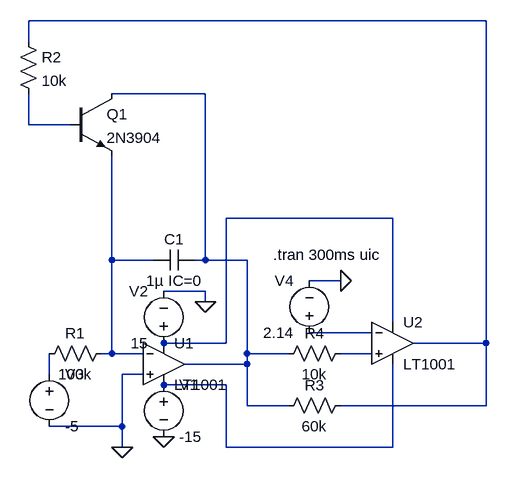
[diagram p0: schematic sawtoothSymbol.asc]
sawtoothSymbol.asc, the LTspice schematic file:
Version 4.1
SHEET 1 1060 680
WIRE 592 -352 -112 -352
WIRE -112 -320 -112 -352
WIRE 160 -240 16 -240
WIRE -112 -192 -112 -240
WIRE -48 -192 -112 -192
WIRE 448 -48 192 -48
WIRE 16 16 16 -144
WIRE 80 16 16 16
WIRE 160 16 160 -240
WIRE 160 16 144 16
WIRE 224 16 160 16
WIRE 368 48 320 48
WIRE 160 64 96 64
WIRE 160 80 160 64
WIRE 448 112 448 -48
WIRE 416 128 320 128
WIRE 192 144 192 -48
WIRE 192 144 96 144
WIRE 592 144 592 -352
WIRE 592 144 480 144
WIRE 16 160 16 16
WIRE 16 160 0 160
WIRE 64 160 16 160
WIRE 224 160 224 16
WIRE 288 160 224 160
WIRE 416 160 368 160
WIRE 224 176 224 160
WIRE 224 176 128 176
WIRE -80 192 -80 160
WIRE 64 192 32 192
WIRE 192 208 96 208
WIRE 224 240 224 176
WIRE 288 240 224 240
WIRE 592 240 592 144
WIRE 592 240 368 240
WIRE 32 272 32 192
WIRE 32 272 -80 272
WIRE 32 304 32 272
WIRE 192 304 192 208
WIRE 448 304 448 176
WIRE 448 304 192 304
FLAG 160 80 0
FLAG 96 288 0
FLAG 32 304 0
FLAG 368 48 0
SYMBOL OpAmps\\LT1001 96 112 R0
SYMATTR InstName U1
SYMBOL voltage 96 192 R0
WINDOW 123 0 0 Left 0
WINDOW 39 0 0 Left 0
SYMATTR InstName V1
SYMATTR Value -15
SYMBOL voltage 96 160 R180
WINDOW 0 24 96 Left 2
WINDOW 3 24 16 Left 2
WINDOW 123 0 0 Left 0
WINDOW 39 0 0 Left 0
SYMATTR InstName V2
SYMATTR Value 15
SYMBOL cap 144 0 R90
WINDOW 0 0 32 VBottom 2
WINDOW 3 32 32 VTop 2
SYMATTR InstName C1
SYMATTR Value 1µ IC=0
SYMBOL res 16 144 R90
WINDOW 0 0 56 VBottom 2
WINDOW 3 32 56 VTop 2
SYMATTR InstName R1
SYMATTR Value 100k
SYMBOL voltage -80 176 R0
WINDOW 123 0 0 Left 0
WINDOW 39 0 0 Left 0
SYMATTR InstName V3
SYMATTR Value -5
SYMBOL voltage 320 144 R180
WINDOW 0 24 96 Left 2
WINDOW 3 24 16 Left 2
WINDOW 123 0 0 Left 0
WINDOW 39 0 0 Left 0
SYMATTR InstName V4
SYMATTR Value 2.14
SYMBOL npn -48 -240 R0
SYMATTR InstName Q1
SYMATTR Value 2N3904
SYMBOL res -128 -336 R0
SYMATTR InstName R2
SYMATTR Value 10k
SYMBOL OpAmps\\LT1001 448 80 R0
SYMATTR InstName U2
SYMBOL res 384 144 R90
WINDOW 0 0 56 VBottom 2
WINDOW 3 32 56 VTop 2
SYMATTR InstName R4
SYMATTR Value 10k
SYMBOL res 384 224 R90
WINDOW 0 0 56 VBottom 2
WINDOW 3 32 56 VTop 2
SYMATTR InstName R3
SYMATTR Value 60k
TEXT 264 8 Left 2 !.tran 300ms uic

The netlist it stands for:
* sawtoothSymbol.asc
X§U1 0 N005 N004 N009 N002 LT1001  ; pins In+ In- V+ V- OUT
V1 N009 0 -15
V2 N004 0 15
C1 N002 N005 1µ IC=0
R1 N005 N008 100k
V3 N008 0 -5
V4 N006 0 2.14
Q1 N002 N003 N005 0 2N3904
R2 N001 N003 10k
X§U2 N007 N006 N004 N009 N001 LT1001  ; pins In+ In- V+ V- OUT
R4 N007 N002 10k
R3 N001 N002 60k
.model NPN NPN
.model PNP PNP
.lib standard.bjt
.tran 300ms uic
.lib LTC.lib
.backanno
.end